# Altium schematic sheet COMBINED.SchDoc
size A3; SheetNumber: 2; SheetTotal: 5
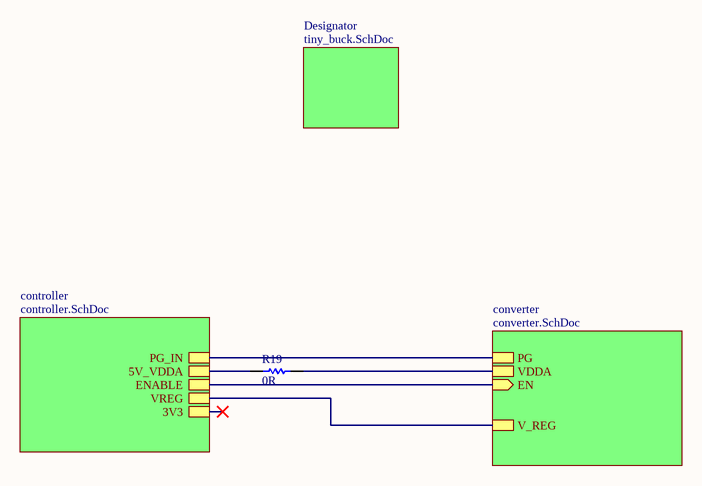
[diagram p0: COMBINED.SchDoc]

## Parts
R19  value 0R  [SMD-0603-RES]  (hidden comment: Resistor)

## Sub-sheets
controller = controller.SchDoc: 5V_VDDA, ENABLE, VREG, 3V3, PG_IN
converter = converter.SchDoc: PG, EN (in), V_REG, VDDA
Designator = tiny_buck.SchDoc: no entries

## Nets
NetR19_1: R19.1 ; sheet controller/5V_VDDA
NetR19_2: R19.2 ; sheet converter/VDDA
(unnamed): sheet converter/PG, sheet controller/PG_IN
(unnamed): sheet converter/EN, sheet controller/ENABLE
(unnamed): sheet converter/V_REG, sheet controller/VREG

## Library data of the parts
R19 = Resistor: TC1: 0; SimulationGenericComponent: True; TC2: 0